# EAGLE design HP03S_HIH6130 (EAGLE 6.3)
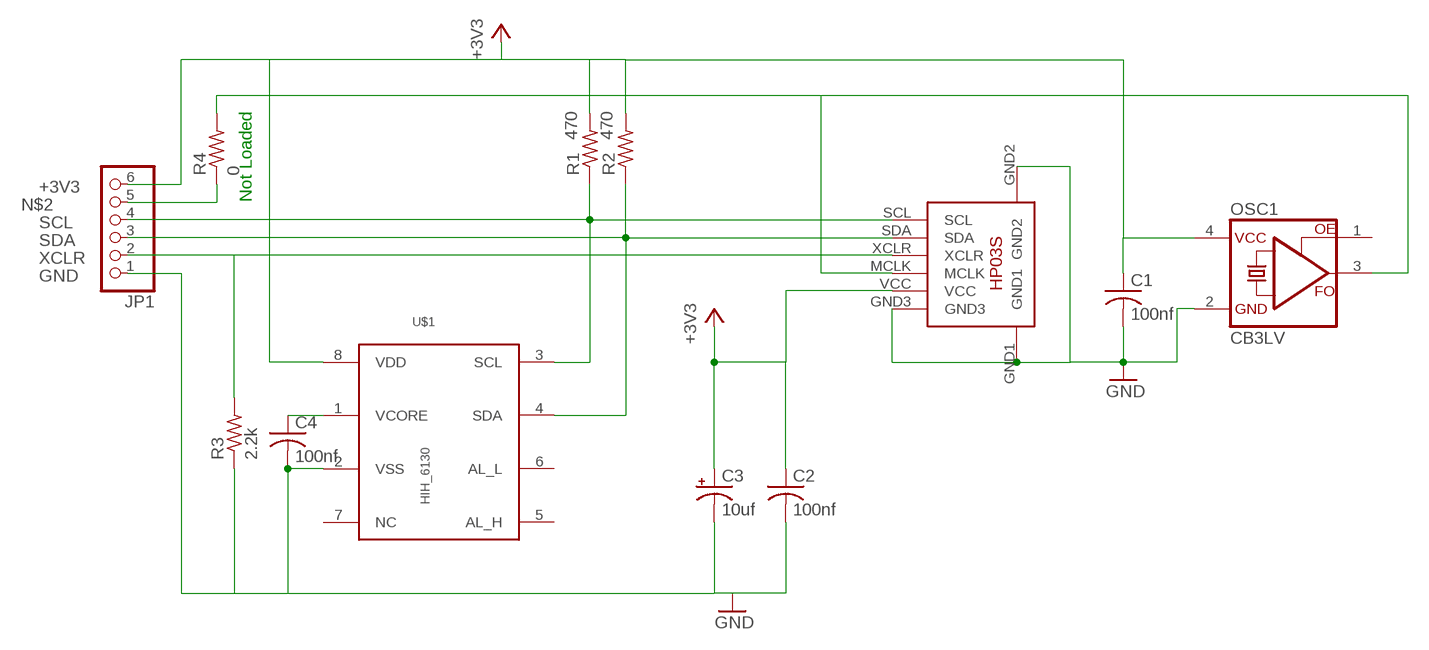
[diagram p0: schematic, sheet 1]

## Parts
C1  100nf  C-USC0805  [C0805]
C2  100nf  C-USC0805K  [C0805K]
C3  10uf  CPOL-USSMCP  [SMC_P]
C4  100nf  C-USC0805K  [C0805K]
JP1  PINHD-1X6  [1X06]
OSC1  CB3LV  [SMD7.5X5MM]
R1  470  R-US_R0603  [R0603]
R2  470  R-US_R0603  [R0603]
R3  2.2k  R-US_R0603  [R0603]
R4  0  R-US_R0603  [R0603]
U$1  HIH_6130  [SOIC8]
U$2  HP03S  [HP03S]

## Nets
+3V3: C1.1 C2.1 C3.+ JP1.6 OSC1.4(VCC) R1.2 R2.2 U$1.8(VDD) U$2.VCC
GND: C1.2 C2.2 C3.- C4.2 JP1.1 OSC1.2(GND) R3.1 U$1.2(VSS) U$2.GND1 U$2.GND2 U$2.GND3
N$1: C4.1 U$1.1(VCORE)
N$2: JP1.5 R4.1
RTCCLK: OSC1.3(FO) R4.2 U$2.MCLK
SCL: JP1.4 R1.1 U$1.3(SCL) U$2.SCL
SDA: JP1.3 R2.1 U$1.4(SDA) U$2.SDA
XCLR: JP1.2 R3.2 U$2.XCLR
Unconnected: OSC1.1(OE) U$1.5(AL_H) U$1.6(AL_L) U$1.7(NC)

## Notes on the sheet
- Not Loaded

## Library data of the parts
C1 C2 C4 = rcl:C-US: CAPACITOR, American symbol
C3 = rcl:CPOL-US: POLARIZED CAPACITOR, American symbol
JP1 = Headers:PINHD-1X6: PIN HEADER
OSC1 = crystal:CB3LV
R1-R4 = rcl:R-US_: RESISTOR, American symbol
U$1 = Stofer:HIH_6130
U$2 = HopeRF:HP03S

## Board
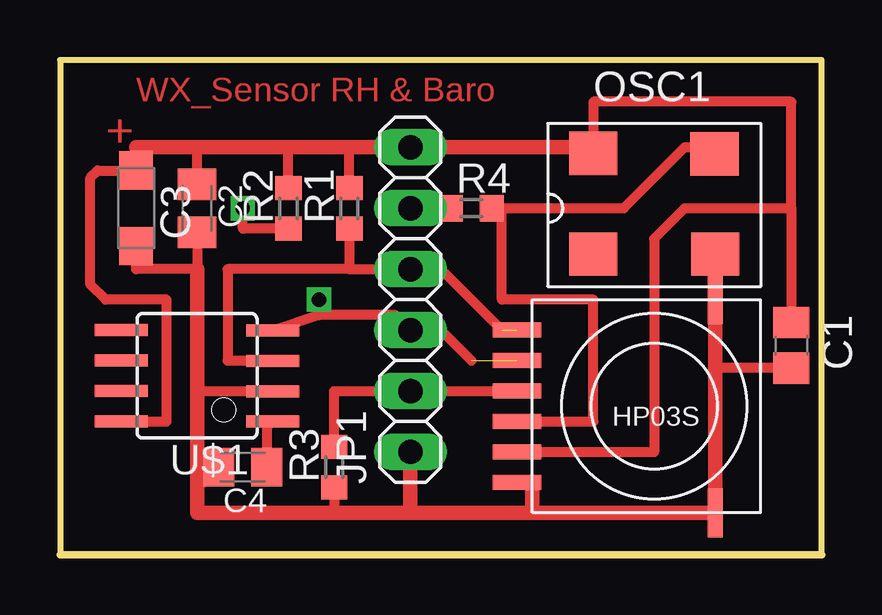
[diagram p1: board, top side]
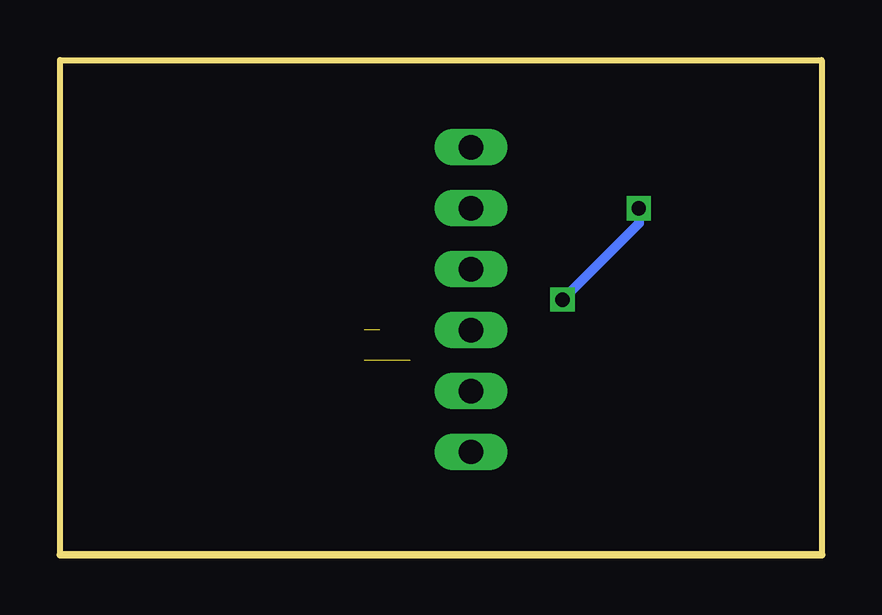
[diagram p2: board, bottom side, seen from below]

Size 31.73 x 20.62 mm. Coordinates in mm from the lower left corner, seen from the top.
Outline: 0,0 31.73,0 31.73,20.62 0,20.62 0,0
Copper layers (1*16): Top 0.035mm / dielectric 0.2mm / Bottom 0.035mm
Design rules: minimum track width 10mil, minimum drill 24mil, track to track 8mil, track to pad 8mil, pad to pad 8mil, via to via 8mil, smd to smd 8mil, copper to edge 40mil, drill to drill 8mil, minimum pad ring 10mil, minimum via ring 8mil, stop-mask expansion 4mil, vias tented up to drill 0mil, thermal gap 10mil

### Footprints (pad centres in the part's own frame; a part is rotated, then mirrored left to right if it is on the bottom)
C0805 = smd 1.3 x 1.5: 1 -0.95,0; 2 0.95,0
C0805K = smd 1.3 x 1.6: 1 -1,0; 2 1,0
SMC_P = smd 1.6 x 1.4: + -1.575,0; - 1.575,0
1X06 = drill 1.016 long: 1 -6.35,0; 2 -3.81,0; 3 -1.27,0; 4 1.27,0; 5 3.81,0; 6 6.35,0
SMD7.5X5MM = smd 2.007 x 1.803: 1 0,0; 2 5.08,0; 3 5.052,4.171; 4 0,4.191
R0603 = smd 1 x 1.1: 1 -0.85,0; 2 0.85,0
SOIC8 = smd 0.5 x 2.2: 1 -1.905,-3.154; 2 -0.645,-3.154; 3 0.625,-3.154; 4 1.895,-3.154; 5 1.905,3.154; 6 0.635,3.154; 7 -0.635,3.154; 8 -1.905,3.154
HP03S = smd 0.635 x 2.032: GND1 -7.62,7.62; GND2 -7.62,-1.27 | smd 2.032 x 0.635: GND3 0.635,6.35; MCLK 0.635,3.81; SCL 0.635,0; SDA 0.635,1.27; VCC 0.635,5.08; XCLR 0.635,2.54

### Placement (x,y rotation side)
C1  30.48,8.73 270 top
C2  5.71,14.44 270 top
C3  3.17,14.44 270 top
C4  7.62,3.64 180 top
JP1  14.6,10.63 90 top
OSC1  22.22,12.54 0 top
R1  12.06,14.44 90 top
R2  9.52,14.44 90 top
R3  11.43,3.64 90 top
R4  17.14,14.44 0 top
U$1  5.71,7.46 90 top
U$2  19.68,9.36 180 top

### Tracks (layer width: path | path; a pad name or v marks a point on that pad's centre or on a via)
+3V3
  Top 0.406: JP1.6 13.33,16.98 | R1.2 12.06,16.98 | R2.2 9.52,16.98 | C2.1 5.71,16.98 | 3.17,16.98 C3.+ 1.57,16.02 1.27,15.71 1.27,11.27 1.9,10.63 4.44,10.63 4.44,5.55 U$1.8 | 21.97,16.98 OSC1.4 | OSC1.4 22.47,16.73 | 30.48,14.44 26.03,14.44 24.76,13.17 24.76,4.28 U$2.VCC | 30.48,14.44 30.48,18.88 22.22,18.88 OSC1.4 | 30.48,14.44 C1.1
  Top 0.61: 3.17,16.98 5.71,16.98 9.52,16.98 12.06,16.98 JP1.6 21.97,16.98
GND
  Top 0.406: C3.- 3.17,11.9 5.71,11.9 C2.2 | R3.1 11.43,1.74 | U$1.2 5.71,6.81 | C4.2 5.98,3.01 5.71,3.01 | C1.2 27.3,7.77 27.3,6.82
  Top 0.61: 14.6,1.74 11.43,1.74 5.71,1.74 5.71,3.01 5.71,6.81 5.71,11.9 | 14.6,1.74 JP1.1 | OSC1.2 U$2.GND2 27.3,6.82 U$2.GND1 19.68,1.74 | 14.6,1.74 19.68,1.74 | U$2.GND3 19.68,3.01 19.68,1.74
N$1
  Top 0.406: U$1.1 8.62,5.3 C4.1
N$2
  Top 0.406: R4.1 JP1.5
RTCCLK
  Top 0.406: 18.41,14.44 18.41,10.63 22.22,10.63 22.22,5.55 U$2.MCLK | 27.27,17.01 OSC1.3 27,16.98 26.03,16.98 23.49,14.44 18.41,14.44 | R4.2 18.41,14.44
SCL  (1 unrouted)
  Top 0.406: 12.06,11.9 JP1.4 15.87,11.9 18.41,9.36 | R1.1 12.06,11.9 | 12.06,11.9 6.98,11.9 6.98,8.09 U$1.3
SDA  (via drill 0.6)  (1 unrouted)
  Top 0.406: 17.14,8.09 15.87,9.36 JP1.3 13.98,9.99 10.79,9.99 | 10.79,9.99 U$1.4 | R2.1 7.62,13.59 v7.62,14.44 | v10.79,10.63 10.79,9.99
  Bottom 0.406: v7.62,14.44 7.62,13.81 v10.79,10.63
XCLR
  Top 0.406: R3.2 11.43,6.82 JP1.2 U$2.XCLR

### Text on the board
Top: WX_Sensor RH & Baro | + | RV Builders ©2012